# EAGLE design KN-CON + LCD 80мм  (EAGLE 6.2)
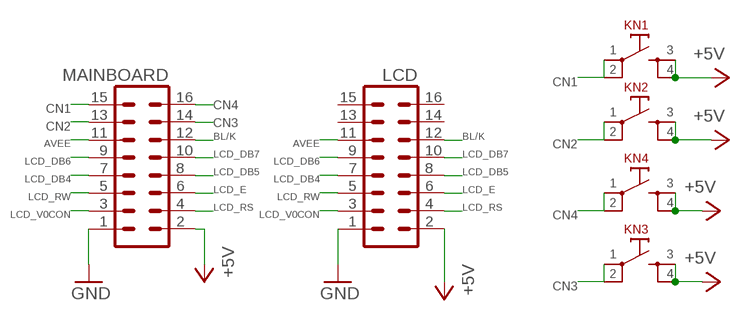
[diagram p0: schematic, sheet 1]

## Parts
KN1  LZQ-KN  [LZQ-KN]
KN2  LZQ-KN  [LZQ-KN]
KN3  LZQ-KN  [LZQ-KN]
KN4  LZQ-KN  [LZQ-KN]
LCD  ML16  [ML16]
MAINBOARD  ML16  [ML16]

## Nets
+5V: KN1.3 KN1.4 KN2.3 KN2.4 KN3.3 KN3.4 KN4.3 KN4.4 LCD.2 MAINBOARD.2
AVEE: LCD.11 MAINBOARD.11
BL/K: LCD.12 MAINBOARD.12
CN1: KN1.1 KN1.2 MAINBOARD.15
CN2: KN2.1 KN2.2 MAINBOARD.13
CN3: KN3.1 KN3.2 MAINBOARD.14
CN4: KN4.1 KN4.2 MAINBOARD.16
GND: LCD.1 MAINBOARD.1
LCD_DB4: LCD.7 MAINBOARD.7
LCD_DB5: LCD.8 MAINBOARD.8
LCD_DB6: LCD.9 MAINBOARD.9
LCD_DB7: LCD.10 MAINBOARD.10
LCD_E: LCD.6 MAINBOARD.6
LCD_RS: LCD.4 MAINBOARD.4
LCD_RW: LCD.5 MAINBOARD.5
LCD_V0CON: LCD.3 MAINBOARD.3
Unconnected: LCD.13 LCD.14 LCD.15 LCD.16

## Library data of the parts
KN1-KN4 = Dmitry:LZQ-KN
LCD MAINBOARD = con-harting-ml:ML16: HARTING; OC_FARNELL: unknown; OC_NEWARK: unknown

## Board
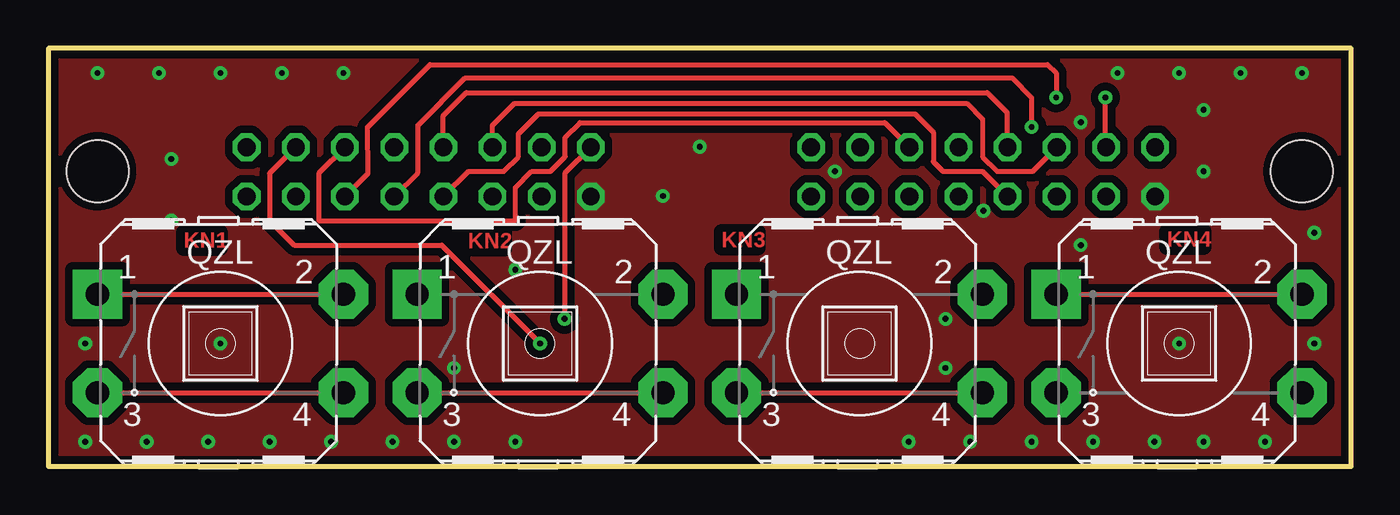
[diagram p1: board, top side]
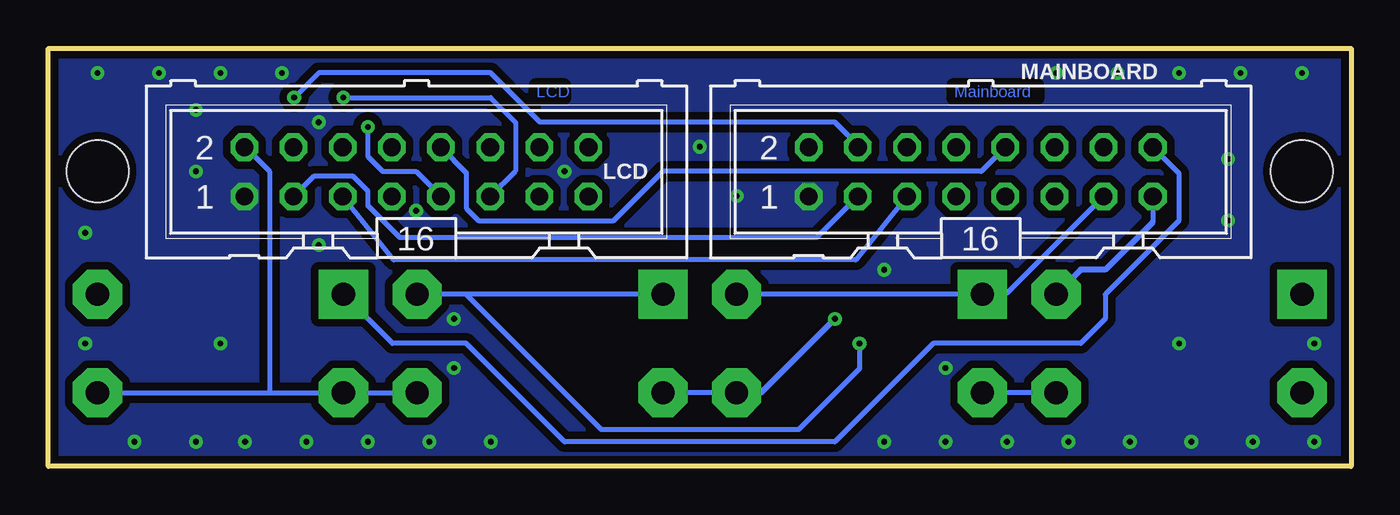
[diagram p2: board, bottom side, seen from below]

Size 67.31 x 21.59 mm. Coordinates in mm from the lower left corner, seen from the top.
Outline: 0,0 67.31,0 67.31,21.59 0,21.59 0,0
Copper layers (1*16): Top 0.035mm / dielectric 1.5mm / Bottom 0.035mm
Design rules: minimum track width 10mil, minimum drill 24mil, track to track 8mil, track to pad 8mil, pad to pad 8mil, via to via 8mil, smd to smd 8mil, copper to edge 10mil, drill to drill 8mil, minimum pad ring 10mil, minimum via ring 8mil, stop-mask expansion 4mil, vias tented up to drill 0mil, thermal gap 10mil
Holes 3.2 mm at 64.77,15.24 2.54,15.24

### Footprints (pad centres in the part's own frame; a part is rotated, then mirrored left to right if it is on the bottom)
LZQ-KN = drill 1.2 pad 2.54 square: 1 -6.35,2.54 | drill 1.2 pad 2.54 octagon: 2 6.35,2.54; 3 -6.35,-2.54; 4 6.35,-2.54
ML16 = drill 0.914 octagon: 1 -8.89,-1.27; 2 -8.89,1.27; 3 -6.35,-1.27; 4 -6.35,1.27; 5 -3.81,-1.27; 6 -3.81,1.27; 7 -1.27,-1.27; 8 -1.27,1.27; 9 1.27,-1.27; 10 1.27,1.27; 11 3.81,-1.27; 12 3.81,1.27; 13 6.35,-1.27; 14 6.35,1.27; 15 8.89,-1.27; 16 8.89,1.27

### Placement (x,y rotation side)
KN1  8.89,6.35 0 top
KN2  25.4,6.35 0 top
KN3  41.91,6.35 0 top
KN4  58.42,6.35 0 top
LCD  48.29,15.21 0 bottom
MAINBOARD  19.14,15.21 0 bottom

### Tracks (layer width: path | path; a pad name or v marks a point on that pad's centre or on a via)
+5V  (via drill 0.3 pad 0.7)
  Top 0.254: KN1.3 KN1.4 | KN3.3 KN3.4 | KN2.3 KN2.4 | MAINBOARD.2 26.67,15.13 v26.67,7.62
  Bottom 0.254: 57.11,16.51 LCD.2 57.12,16.48 55.88,15.24 55.88,3.81 | KN1.4 KN2.3 | KN3.4 KN4.3 55.88,3.81 | KN4.4 55.88,3.81 | KN2.4 KN3.3
  Bottom 0.305: v26.67,7.62 30.48,3.81 KN2.4
AVEE  (via drill 0.3 pad 0.7)
  Top 0.254: MAINBOARD.11 16.51,15.13 16.48,17.53 19.71,20.75 51.64,20.75 52.07,20.32 v52.07,19.05
  Bottom 0.254: LCD.11 43.18,15.25 43.18,17.78 44.45,19.05 v52.07,19.05
BL/K
  Top 0.254: MAINBOARD.12 13.97,15.13 13.97,12.7 24.13,12.7 24.13,14.4 24.97,15.24 25.93,15.24 26.7,16 26.7,16.99 27.46,17.75 43.22,17.75 LCD.12
  Bottom 0.254: 44.45,16.52 LCD.12
CN1
  Top 0.254: KN1.1 KN1.2
  Bottom 0.254: MAINBOARD.15 10.25,12.61
  Bottom 0.305: 10.25,12.61 12.7,10.16 13.97,10.16 KN1.2
CN2
  Bottom 0.254: KN2.2 KN2.1 17.78,8.95 MAINBOARD.13
CN3  (via drill 0.3 pad 0.7)
  Top 0.254: MAINBOARD.14 11.43,15.13 11.43,12.7 12.7,11.43 20.32,11.43 v25.4,6.35
  Bottom 0.254: v25.4,6.35 25.4,5.05 28.55,1.91 38.73,1.91 45.72,8.89 | KN3.1 45.72,8.89 | 45.72,8.89 KN3.2
CN4
  Top 0.254: KN4.1 KN4.2
  Bottom 0.254: MAINBOARD.16 8.89,15.13 8.89,12.7 12.7,8.89 12.7,7.62 13.97,6.35 21.59,6.35 26.67,1.27 40.64,1.27 45.72,6.35 49.53,6.35 KN4.1
GND  (via drill 0.3 pad 0.7)
  other vias: 8.89,6.35 24.13,10.16 53.34,17.78 48.31,13.21 33.66,16.51 31.75,13.97 59.69,15.24 59.69,18.41 65.41,12.06 65.41,6.35 58.42,6.35 44.45,1.27 46.35,5.08 40.64,15.24 24.13,1.27 5.08,1.27 53.34,11.43 6.35,15.88 2.54,20.32 6.35,12.7 5.71,20.32 8.89,20.32 12.06,20.32 15.24,20.32 1.91,6.35 1.91,1.27 8.26,1.27 11.43,1.27 14.61,1.27 17.78,1.27 20.95,1.27 47.62,1.27 50.8,1.27 53.98,1.27 57.15,1.27 59.69,1.27 62.87,1.27 55.24,20.32 58.42,20.32 61.59,20.32 64.77,20.32 46.35,7.62 20.95,5.08
  pour Top (isolate 0.406, no thermals): 0,21.59 0,0 67.31,0 67.31,21.59
  pour Bottom (isolate 0.406, no thermals): 0,21.59 67.31,21.59 67.31,0 0,0
LCD_DB4
  Top 0.254: MAINBOARD.7 21.7,15.24 23.52,15.24 24.28,16 24.28,17.17 25.32,18.21 44.78,18.21 45.72,17.27 45.72,15.75 46.23,15.24 48.26,15.24 LCD.7
LCD_DB5
  Top 0.254: MAINBOARD.8 20.41,18.12 21.59,19.3 48.51,19.3 49.53,18.29 49.53,16.52 LCD.8
LCD_DB6  (via drill 0.3 pad 0.7)
  Top 0.254: MAINBOARD.9 19.1,15.18 19.1,17.63 21.54,20.07 49.78,20.07 50.8,19.05 v50.8,17.53
  Bottom 0.254: LCD.9 48.32,15.24 50.04,15.24 50.8,16 v50.8,17.53
LCD_DB7
  Bottom 0.254: MAINBOARD.10 19.11,15.24 35.56,15.24 38.1,12.7 45.09,12.7 45.72,13.34 45.72,15.18 LCD.10
LCD_E
  Top 0.254: MAINBOARD.6 22.95,17.61 24.08,18.75 47.45,18.75 48.26,17.93 48.26,16 49.02,15.24 50.86,15.24 LCD.6
LCD_RS  (via drill 0.3 pad 0.7)
  Top 0.254: LCD.4 54.61,16.52 v54.61,19.05
  Bottom 0.254: MAINBOARD.4 25.49,16.6 26.67,17.78 41.91,17.78 44.45,20.32 53.34,20.32 v54.61,19.05
LCD_RW
  Bottom 0.254: MAINBOARD.5 25.59,10.67 49.46,10.67 LCD.5
LCD_V0CON
  Bottom 0.254: MAINBOARD.3 27.62,11.81 49.15,11.81 50.8,13.46 50.8,14.22 51.56,14.99 53.6,14.99 LCD.3

### Text on the board
Bottom: Mainboard | LCD
Drill_legend: Drill legend | Date: 05.05.2012 14:55:05 | 3.2000 mm / 125.984 mil | 1.2000 mm / 47.244 mil | 1.0000 mm / 39.370 mil | 0.8000 mm / 31.496 mil